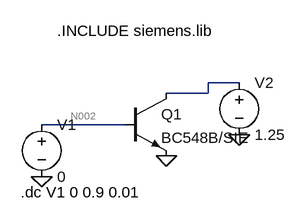
[diagram p0: schematic tbjsiemensIDvsVBE.asc]
tbjsiemensIDvsVBE.asc, the LTspice schematic file:
Version 4
SHEET 1 880 680
WIRE 320 96 272 96
WIRE 272 112 272 96
WIRE 272 112 208 112
WIRE 144 160 16 160
FLAG 208 208 0
FLAG 320 176 0
FLAG 16 240 0
SYMBOL voltage 16 144 R0
WINDOW 123 0 0 Left 2
WINDOW 39 0 0 Left 2
SYMATTR InstName V1
SYMATTR Value 0
SYMBOL voltage 320 80 R0
WINDOW 123 0 0 Left 2
WINDOW 39 0 0 Left 2
SYMATTR InstName V2
SYMATTR Value 1.25
SYMBOL npn 144 112 R0
SYMATTR InstName Q1
SYMATTR Value BC548B/SIE
TEXT 40 16 Left 2 !.INCLUDE siemens.lib
TEXT -16 264 Left 2 !.dc V1 0 0.9 0.01

The netlist it stands for:
* tbjsiemensIDvsVBE.asc
V1 N002 0 0
V2 N001 0 1.25
Q1 N001 N002 0 0 BC548B/SIE
.model NPN NPN
.model PNP PNP
.lib standard.bjt
.INCLUDE siemens.lib
.dc V1 0 0.9 0.01
.backanno
.end

* Results of the author's LTspice run, read from the files saved beside the schematic
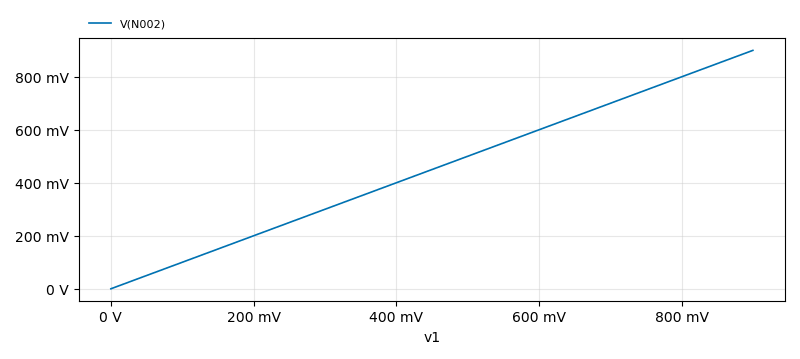
[diagram p1: DC transfer characteristic of tbjsiemensIDvsVBE.asc, plotted from the saved traces]
* DC transfer characteristic, 1 run:
*   V(N002): 0 V at v1=0 V, 900 mV at v1=900 mV, min 0 V, max 900 mV